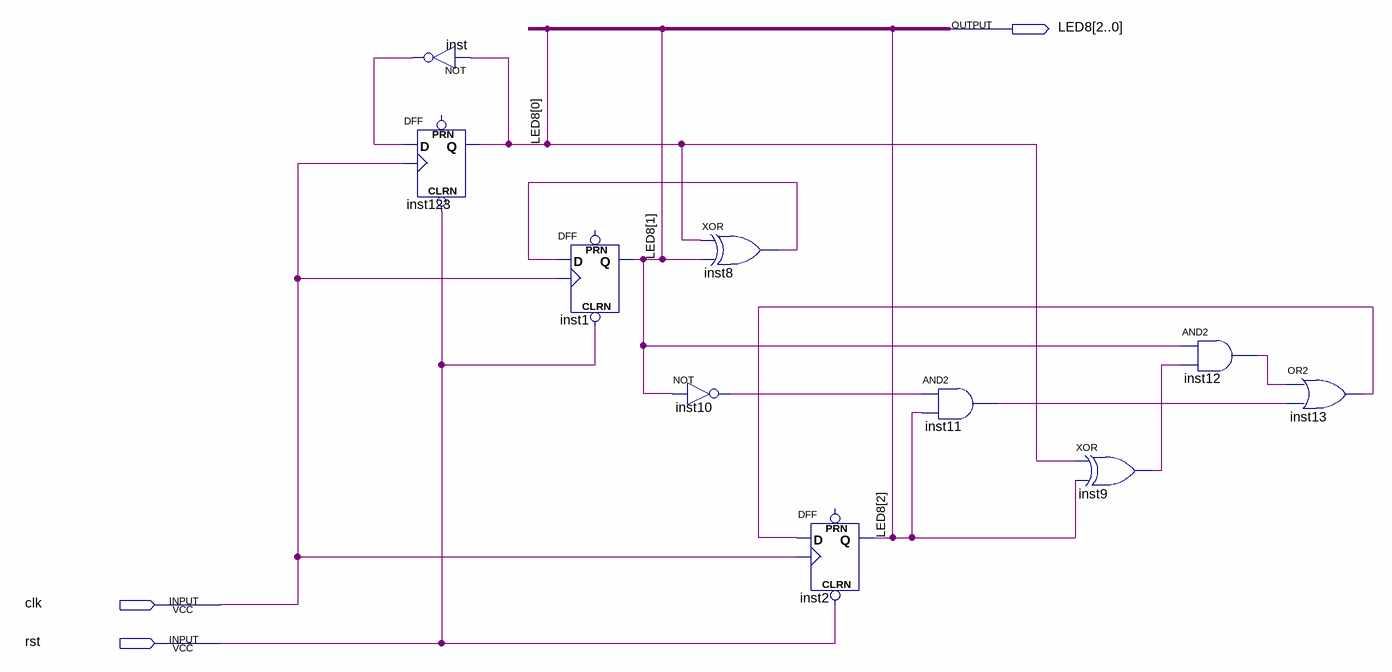
[diagram p0: schematic sheet]
// Quartus schematic threeBitCounter.bdf as structural Verilog: 10 symbols, 3 pins
module threeBitCounter (
  input  clk,
  input  rst,
  output [2:0] LED8
);

  wire inst8_out, inst9_out, inst10_out, inst11_out, inst12_out, inst13_out, inst_out;

  not inst (inst_out, LED8[0]);
  DFF inst123 (.CLRN(rst), .CLK(clk), .D(inst_out), .Q(LED8[0]));  // open: PRN
  DFF inst1 (.CLRN(rst), .CLK(clk), .D(inst8_out), .Q(LED8[1]));  // open: PRN
  xor inst8 (inst8_out, LED8[0], LED8[1]);
  not inst10 (inst10_out, LED8[1]);
  DFF inst2 (.CLRN(rst), .CLK(clk), .D(inst13_out), .Q(LED8[2]));  // open: PRN
  and inst11 (inst11_out, inst10_out, LED8[2]);
  xor inst9 (inst9_out, LED8[0], LED8[2]);
  and inst12 (inst12_out, LED8[1], inst9_out);
  or inst13 (inst13_out, inst12_out, inst11_out);
endmodule
